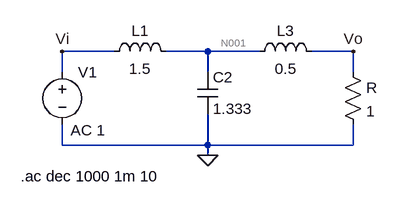
[diagram p0: schematic simulacion circuital cuadripolo red.asc]
simulacion circuital cuadripolo red.asc, the LTspice schematic file:
Version 4
SHEET 1 880 680
WIRE 64 128 -16 128
WIRE 208 128 144 128
WIRE 288 128 208 128
WIRE 432 128 368 128
WIRE -16 160 -16 128
WIRE 208 160 208 128
WIRE 432 160 432 128
WIRE -16 272 -16 240
WIRE 208 272 208 224
WIRE 208 272 -16 272
WIRE 432 272 432 240
WIRE 432 272 208 272
WIRE 208 288 208 272
FLAG 432 128 Vo
FLAG -16 128 Vi
FLAG 208 288 0
SYMBOL ind 48 144 R270
WINDOW 0 32 56 VTop 2
WINDOW 3 5 56 VBottom 2
SYMATTR InstName L1
SYMATTR Value 1.5
SYMBOL ind 272 144 R270
WINDOW 0 32 56 VTop 2
WINDOW 3 5 56 VBottom 2
SYMATTR InstName L3
SYMATTR Value 0.5
SYMBOL cap 192 160 R0
SYMATTR InstName C2
SYMATTR Value 1.333
SYMBOL res 416 144 R0
SYMATTR InstName R
SYMATTR Value 1
SYMBOL voltage -16 144 R0
WINDOW 123 13 105 Left 2
WINDOW 39 0 0 Left 0
SYMATTR InstName V1
SYMATTR Value ""
SYMATTR Value2 AC 1
TEXT -80 320 Left 2 !.ac dec 1000 1m 10

The netlist it stands for:
* simulacion circuital cuadripolo red.asc
L1 Vi N001 1.5
L3 N001 Vo 0.5
C2 N001 0 1.333
R Vo 0 1
V1 Vi 0 AC 1
.ac dec 1000 1m 10
.backanno
.end

* Results of the author's LTspice run, read from the files saved beside the schematic
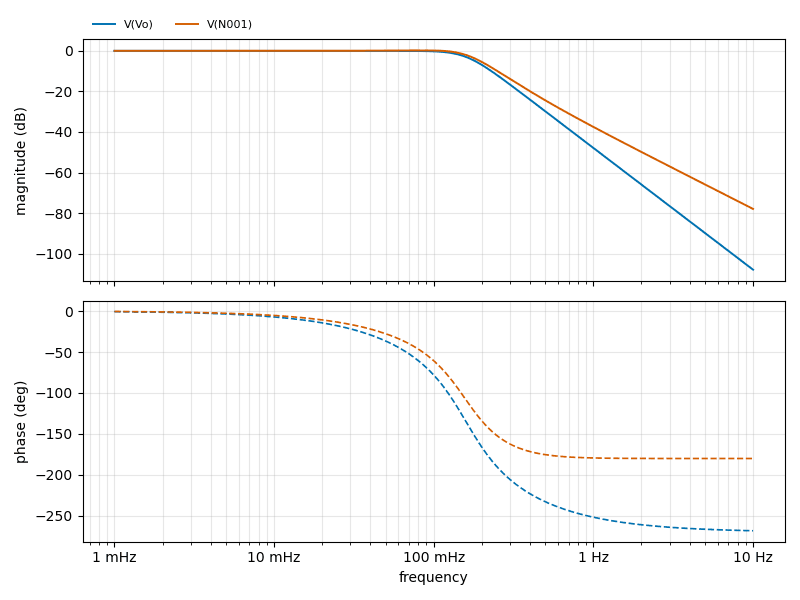
[diagram p1: AC Analysis of simulacion circuital cuadripolo red.asc, plotted from the saved traces]
* AC Analysis, 1 run:
*   V(Vo): -0.02 dB at 1 mHz, -107.89 dB at 10 Hz, peak -0.02 dB at 34.12 mHz, 3 dB below the peak at 159.3 mHz
*   V(N001): -0.01 dB at 1 mHz, -77.94 dB at 10 Hz, peak 0.20 dB at 84.92 mHz, 3 dB below the peak at 169.4 mHz